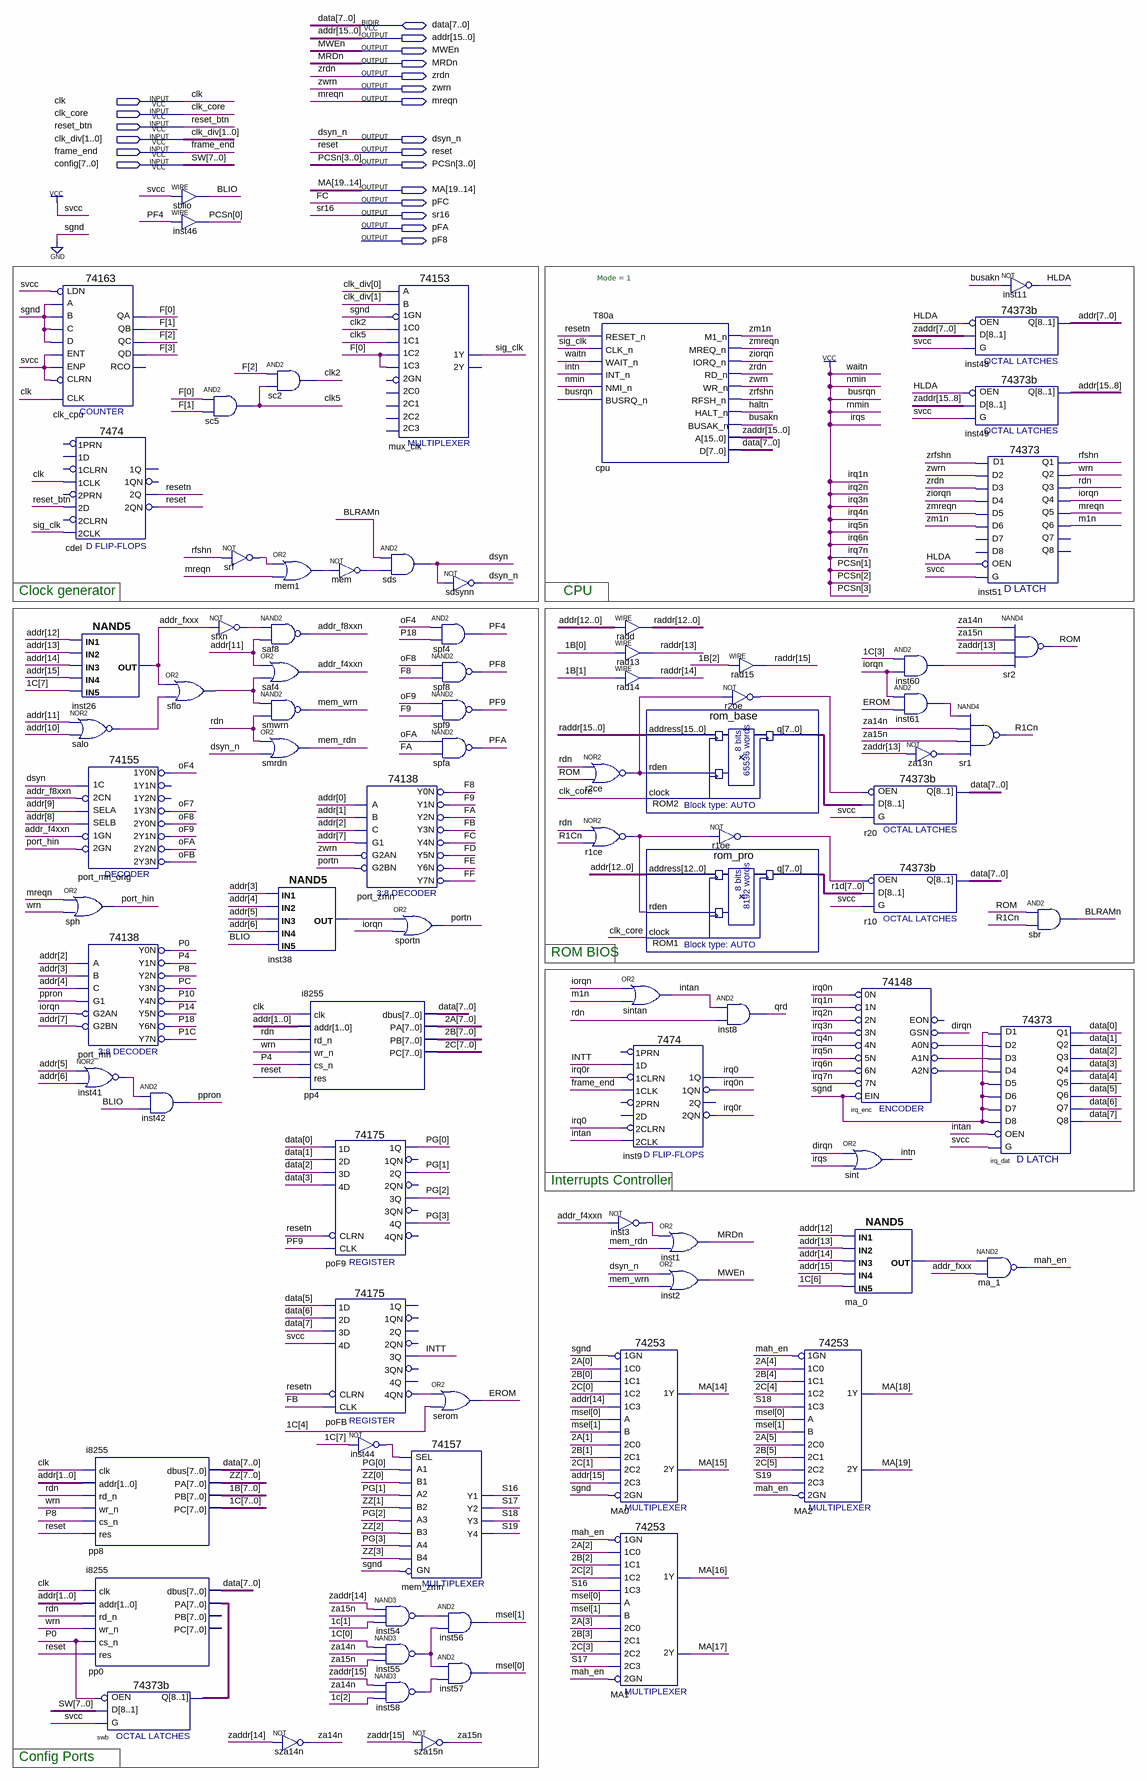
[diagram p0: schematic sheet]
// Quartus schematic orion_pro_cpu_sch.bdf as structural Verilog: 85 symbols, 21 pins
module orion_pro_cpu_sch (
  input  clk,
  input  clk_core,
  input  reset_btn,
  input  [1:0] clk_div,
  input  frame_end,
  input  [7:0] \config ,
  inout  [7:0] data,
  output [15:0] addr,
  output MWEn,
  output MRDn,
  output zrdn,
  output zwrn,
  output mreqn,
  output dsyn_n,
  output reset,
  output [3:0] PCSn,
  output [19:14] MA,
  output pFC,
  output sr16,
  output pFA,
  output pF8
);

  wire addr_f4xxn, addr_f8xxn, addr_fxxx, BLIO, BLRAMn, busakn, clk2, clk5, dirqn, dsyn, EROM, F8, F9, FA,
       FB, FD, FE, FF, haltn, HLDA, inst3_out, inst38_out, inst41_out, inst44_out, inst54_out, inst55_out,
       inst58_out, inst60_out, inst61_out, intan, intn, INTT, iorqn, irq0, irq0n, irq0r, irq_enc_a0n,
       irq_enc_a1n, irq_enc_a2n, m1n, ma_0_out, mah_en, mem1_out, mem_out, mem_rdn, mem_wrn, oF4, oF7, oF8,
       oF9, oFA, oFB, P0, P1C, P4, P8, P10, P14, P18, PC, PF4, PF9, poFB_4qn, port_hin, portn, ppron, qrd,
       r1ce_out, R1Cn, r1oe_out, r2ce_out, r2oe_out, rdn, resetn, rfshn, ROM, S16, S17, S18, S19, salo_out,
       sflo_out, sfxn_out, sig_clk, srf_out, wrn, za13n_out, za14n, za15n, ziorqn, zm1n, zmreqn, zrfshn;
  wire [1:0] msel;
  wire [3:0] F, PG;
  wire [7:0] \1B , \1C , \2A , \2B , \2C , pp0_pa, r1d, ROM2_q, ZZ;
  wire [15:0] raddr, zaddr;

  \74163  clk_cpu (
    .C(1'b0), .B(1'b0), .A(1'b0), .ENT(1'b1), .D(1'b0), .CLRN(1'b1), .CLK(clk), .ENP(1'b1), .LDN(1'b1),
    .QA(F[0]), .QB(F[1]), .QC(F[2]), .QD(F[3]));  // open: RCO
  \7474  cdel (
    .\2D (reset_btn), .\1CLK (clk), .\2CLK (sig_clk), .\2Q (resetn), .\2QN (reset));  // open: 2PRN, 1D, 1PRN, 2CLRN, 1CLRN, 1QN, 1Q
  nand inst26 (addr_fxxx, addr[12], addr[13], addr[14], addr[15], \1C [7]);
  nor salo (salo_out, addr[11], addr[10]);
  \74155  port_mn_orig (
    .\1C (dsyn), .\2CN (addr_f8xxn), .SELB(addr[8]), .SELA(addr[9]), .\1GN (addr_f4xxn), .\2GN (port_hin),
    .\1Y0N (oF4), .\2Y1N (oF9), .\2Y0N (oF8), .\1Y3N (oF7), .\2Y3N (oFB), .\2Y2N (oFA));  // open: 1Y2N, 1Y1N
  or sph (port_hin, mreqn, wrn);
  \74138  port_mn (
    .A(addr[2]), .B(addr[3]), .G1(ppron), .C(addr[4]), .G2AN(iorqn), .G2BN(addr[7]), .Y0N(P0), .Y1N(P4),
    .Y2N(P8), .Y3N(PC), .Y4N(P10), .Y5N(P14), .Y6N(P18), .Y7N(P1C));
  nor inst41 (inst41_out, addr[5], addr[6]);
  i8255 pp8 (
    .clk(clk), .addr(addr[1:0]), .rd_n(rdn), .wr_n(wrn), .cs_n(P8), .res(reset), .dbus(data), .PA(ZZ),
    .PB(\1B ), .PC(\1C ));
  i8255 pp0 (
    .clk(clk), .addr(addr[1:0]), .rd_n(rdn), .wr_n(wrn), .cs_n(P0), .res(reset), .dbus(data), .PA(pp0_pa));  // open: PB, PC
  \74373b  swb (.D(\config ), .G(1'b1), .OEN(P0), .Q(pp0_pa));
  and inst42 (ppron, inst41_out, BLIO);
  assign BLIO = 1'b1;  // WIRE sblio
  assign PCSn[0] = PF4;  // WIRE inst46
  and sc5 (clk5, F[0], F[1]);
  not sfxn (sfxn_out, addr_fxxx);
  or sflo (sflo_out, addr_fxxx, salo_out);
  not srf (srf_out, rfshn);
  nand saf8 (addr_f8xxn, sfxn_out, addr[11]);
  or saf4 (addr_f4xxn, addr[11], sflo_out);
  nand smwrn (mem_wrn, sflo_out, rdn);
  or smrdn (mem_rdn, rdn, dsyn_n);
  and sc2 (clk2, F[2], clk5);
  or mem1 (mem1_out, srf_out, mreqn);
  nand inst38 (inst38_out, addr[3], addr[4], addr[5], addr[6], BLIO);
  i8255 pp4 (
    .clk(clk), .addr(addr[1:0]), .rd_n(rdn), .wr_n(wrn), .cs_n(P4), .res(reset), .dbus(data), .PA(\2A ),
    .PB(\2B ), .PC(\2C ));
  not sza14n (za14n, zaddr[14]);
  not mem (mem_out, mem1_out);
  \74138  port_zmn (
    .A(addr[0]), .B(addr[1]), .G1(addr[7]), .C(addr[2]), .G2AN(zwrn), .G2BN(portn), .Y0N(F8), .Y1N(F9),
    .Y2N(FA), .Y3N(FB), .Y4N(pFC), .Y5N(FD), .Y6N(FE), .Y7N(FF));
  \74175  poF9 (
    .CLRN(resetn), .CLK(PF9), .\3D (data[2]), .\2D (data[1]), .\1D (data[0]), .\4D (data[3]), .\1Q (PG[0]),
    .\3Q (PG[2]), .\2Q (PG[1]), .\4Q (PG[3]));  // open: 1QN, 2QN, 4QN, 3QN
  \74175  poFB (
    .CLRN(resetn), .CLK(FB), .\3D (data[7]), .\2D (data[6]), .\1D (data[5]), .\4D (1'b1), .\3Q (INTT),
    .\4QN (poFB_4qn));  // open: 1QN, 1Q, 2QN, 2Q, 4Q, 3QN
  not inst44 (inst44_out, \1C [7]);
  \74153  mux_clk (
    .\1C1 (clk5), .\1GN (1'b0), .\1C0 (clk2), .\1C2 (F[0]), .\1C3 (F[0]), .B(clk_div[1]), .A(clk_div[0]),
    .\1Y (sig_clk));  // open: 2C0, 2GN, 2C2, 2C1, 2C3, 2Y
  and sds (dsyn, BLRAMn, mem_out);
  or sportn (portn, inst38_out, iorqn);
  \74157  mem_zmn (
    .A1(PG[0]), .B1(ZZ[0]), .SEL(inst44_out), .B2(ZZ[1]), .A3(PG[2]), .B3(ZZ[2]), .A2(PG[1]), .B4(ZZ[3]),
    .GN(1'b0), .A4(PG[3]), .Y2(S17), .Y1(S16), .Y4(S19), .Y3(S18));
  nand inst54 (inst54_out, zaddr[14], za15n, \1C [1]);
  nand inst55 (inst55_out, \1C [0], za14n, za15n);
  nand inst58 (inst58_out, zaddr[15], za14n, \1C [2]);
  not sza15n (za15n, zaddr[15]);
  not sdsynn (dsyn_n, dsyn);
  and spf4 (PF4, oF4, P18);
  nand spf8 (pF8, oF8, F8);
  nand spf9 (PF9, oF9, F9);
  nand spfa (pFA, oFA, FA);
  or serom (EROM, poFB_4qn, \1C [4]);
  and inst56 (msel[1], inst54_out, inst55_out);
  and inst57 (msel[0], inst55_out, inst58_out);
  T80a #(.Mode(1)) cpu (
    .RESET_n(resetn), .CLK_n(sig_clk), .WAIT_n(1'b1), .INT_n(intn), .NMI_n(1'b1), .BUSRQ_n(1'b1),
    .M1_n(zm1n), .MREQ_n(zmreqn), .IORQ_n(ziorqn), .RD_n(zrdn), .WR_n(zwrn), .RFSH_n(zrfshn), .HALT_n(haltn),
    .BUSAK_n(busakn), .A(zaddr), .D(data));
  assign raddr[12:0] = addr[12:0];  // WIRE radd
  assign raddr[13] = \1B [0];  // WIRE rad13
  assign raddr[14] = \1B [1];  // WIRE rad14
  nor r2ce (r2ce_out, rdn, ROM);
  nor r1ce (r1ce_out, rdn, R1Cn);
  not inst3 (inst3_out, addr_f4xxn);
  \74253  MA0 (
    .\1GN (1'b0), .\1C3 (addr[14]), .\1C2 (\2C [0]), .\2C2 (\2C [1]), .\2C3 (addr[15]), .\1C1 (\2B [0]),
    .\1C0 (\2A [0]), .\2C1 (\2B [1]), .\2C0 (\2A [1]), .B(msel[1]), .A(msel[0]), .\2GN (1'b0), .\2Y (MA[15]),
    .\1Y (MA[14]));
  \74253  MA1 (
    .\1GN (mah_en), .\1C3 (S16), .\1C2 (\2C [2]), .\2C2 (\2C [3]), .\2C3 (S17), .\1C1 (\2B [2]),
    .\1C0 (\2A [2]), .\2C1 (\2B [3]), .\2C0 (\2A [3]), .B(msel[1]), .A(msel[0]), .\2GN (mah_en),
    .\2Y (MA[17]), .\1Y (MA[16]));
  rom_base ROM2 (.address(raddr), .rden(r2ce_out), .clock(clk_core), .q(ROM2_q));
  rom_pro ROM1 (.address(addr[12:0]), .rden(r1ce_out), .clock(clk_core), .q(r1d));
  or sintan (intan, iorqn, m1n);
  \7474  inst9 (
    .\1CLK (frame_end), .\1D (INTT), .\2CLK (intan), .\2CLRN (irq0), .\1CLRN (irq0r), .\1QN (irq0n),
    .\2QN (irq0r), .\1Q (irq0));  // open: 2D, 2PRN, 1PRN, 2Q
  or inst1 (MRDn, inst3_out, mem_rdn);
  or inst2 (MWEn, dsyn_n, mem_wrn);
  not r1oe (r1oe_out, r1ce_out);
  and inst8 (qrd, intan, rdn);
  assign raddr[15] = \1B [2];  // WIRE rad15
  not r2oe (r2oe_out, r2ce_out);
  \74253  MA2 (
    .\1GN (mah_en), .\1C3 (S18), .\1C2 (\2C [4]), .\2C2 (\2C [5]), .\2C3 (S19), .\1C1 (\2B [4]),
    .\1C0 (\2A [4]), .\2C1 (\2B [5]), .\2C0 (\2A [5]), .B(msel[1]), .A(msel[0]), .\2GN (mah_en),
    .\2Y (MA[19]), .\1Y (MA[18]));
  \74373b  r20 (.D(ROM2_q), .G(1'b1), .OEN(r2oe_out), .Q(data));
  \74373b  r10 (.D(r1d), .G(1'b1), .OEN(r1oe_out), .Q(data));
  \74148  irq_enc (
    .\5N (1'b1), .\0N (irq0n), .\1N (1'b1), .\2N (1'b1), .\3N (1'b1), .\4N (1'b1), .EIN(1'b0), .\6N (1'b1),
    .\7N (1'b1), .A1N(irq_enc_a1n), .A0N(irq_enc_a0n), .A2N(irq_enc_a2n), .GSN(dirqn));  // open: EON
  or sint (intn, dirqn, 1'b1);
  nand ma_0 (ma_0_out, addr[12], addr[13], addr[14], addr[15], \1C [6]);
  and inst60 (inst60_out, \1C [3], iorqn);
  and inst61 (inst61_out, iorqn, EROM);
  not za13n (za13n_out, zaddr[13]);
  \74373b  inst48 (.D(zaddr[7:0]), .G(1'b1), .OEN(HLDA), .Q(addr[7:0]));
  \74373b  inst49 (.D(zaddr[15:8]), .G(1'b1), .OEN(HLDA), .Q(addr[15:8]));
  nand sr1 (R1Cn, inst61_out, za14n, za15n, za13n_out);
  not inst11 (HLDA, busakn);
  \74373  inst51 (
    .D1(zrfshn), .D3(zrdn), .D6(zm1n), .D2(zwrn), .G(1'b1), .D4(ziorqn), .D5(zmreqn), .OEN(HLDA), .Q3(rdn),
    .Q6(m1n), .Q2(wrn), .Q4(iorqn), .Q5(mreqn), .Q1(rfshn));  // open: D7, D8, Q7, Q8
  nand sr2 (ROM, za14n, za15n, zaddr[13], inst60_out);
  \74373  irq_dat (
    .D1(1'b0), .D3(irq_enc_a1n), .D6(1'b0), .D7(1'b0), .D2(irq_enc_a0n), .G(1'b1), .D4(irq_enc_a2n),
    .D5(1'b0), .D8(1'b0), .OEN(intan), .Q3(data[2]), .Q6(data[5]), .Q7(data[6]), .Q2(data[1]), .Q8(data[7]),
    .Q4(data[3]), .Q5(data[4]), .Q1(data[0]));
  nand ma_1 (mah_en, ma_0_out, addr_fxxx);
  and sbr (BLRAMn, ROM, R1Cn);

  assign PCSn[3:1] = 3'b111;

  // Other names for the same wires on the sheet: FC = pFC; SW[7:0] = \config 

  // Notes on the sheet:
  //   Clock generator
  //   CPU
  //   ROM BIOS
  //   Interrupts Controller
  //   Config Ports
endmodule
